# Altium project Track_Emulator.PrjPcb
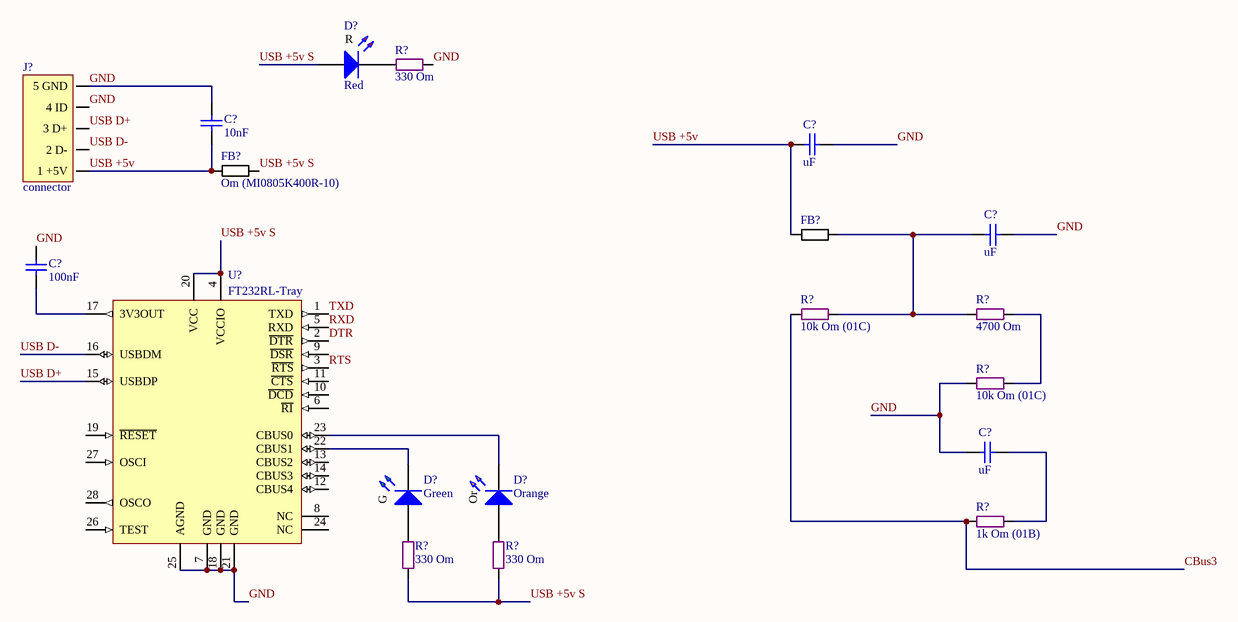
[diagram p0: Track_Emulator.SchDoc]
1 sheet, 19 parts. Net scope: global (net labels, ports and power ports of the same name join across sheets).

## Sheet Track_Emulator.SchDoc
size A4

### Parts
(Parts that share a designator on the sheet are numbered #1, #2 ... from top to bottom, then left to right.)
C?#1  10nF  [SMD 1206 (3216)]
C?#2  uF  [SMD 0805 (2012)]
C?#3  uF  [SMD 0805 (2012)]
C?#4  100nF  [SMD 1206 (3216)]
C?#5  uF  [SMD 0805 (2012)]
D?#1  Red  [LED SMD 0805 Red]
D?#2  Green  [LED SMD 0805 Green]
D?#3  Orange  [LED SMD 0805 Orange]
FB?#1  Om (MI0805K400R-10)  [SMD 1206 (3216)]
FB?#2  (no value)  [SMD 0805 (2012)]
J?  connector  [USB Mini]
R?#1  330 Om  [SMD 0805 (2012)]
R?#2  10k Om (01C)  [SMD 0805 (2012)]
R?#3  4700 Om  [SMD 0805 (2012)]
R?#4  10k Om (01C)  [SMD 0805 (2012)]
R?#5  1k Om (01B)  [SMD 0805 (2012)]
R?#6  330 Om  [SMD 0805 (2012)]
R?#7  330 Om  [SMD 0805 (2012)]
U?  FT232RL-Tray  [SSOP-28_N]

### Nets
CBus3: R?#2.1 R?#5.1
DTR: U?.2(~{DTR})
GND: C?#1.1 C?#2.2 C?#3.2 C?#4.1 C?#5.1 J?.4(4_ID) J?.5(5_GND) R?#1.2 R?#4.1 U?.7(GND) U?.18(GND) U?.21(GND) U?.25(AGND)
RTS: U?.3(~{RTS})
RXD: U?.5(RXD)
TXD: U?.1(TXD)
USB +5v: C?#1.2 C?#2.1 FB?#1.1 FB?#2.1 J?.1(1_+5V)
USB +5v S: D?#1.A FB?#1.2 R?#6.1 R?#7.1 U?.4(VCCIO) U?.20(VCC)
USB D+: J?.3(3_D+) U?.15(USBDP)
USB D-: J?.2(2_D-) U?.16(USBDM)
NetC?#3_1: C?#3.1 FB?#2.2 R?#2.2 R?#3.1
NetC?#4_2: C?#4.2 U?.17(3V3OUT)
NetC?#5_2: C?#5.2 R?#5.2
NetD?#1_K: D?#1.K R?#1.1
NetD?#2_A: D?#2.A R?#6.2
NetD?#2_K: D?#2.K U?.22(CBUS1)
NetD?#3_A: D?#3.A R?#7.2
NetD?#3_K: D?#3.K U?.23(CBUS0)
NetR?#3_2: R?#3.2 R?#4.2

Not connected (* = marked no-connect by the designer): U? 6(~{RI}) 8(NC) 9(~{DSR}) 10(~{DCD}) 11(~{CTS}) 12(CBUS4) 13(CBUS2) 14(CBUS3) 19(~{RESET}) 24(NC) 26(TEST) 27(OSCI) 28(OSCO)

### Notes on the sheet
- (in symbol Led SMD 0805 Green) G
- (in symbol Led SMD 0805 Orange) Or
- (in symbol Led SMD 0805 Red) R

### Library data of the parts
C?#1-C?#5 = Cap SMD 0402-1812: Capacitor
D?#1 = Led SMD 0805 Red: ?2v ?20mA; Forward Voltage TYP: ?2; Resistor for 5v VCC: 330 Om; Forward Voltage Min: ?; Wave len min/typ: ?; Liminous Min (mcd): ?; Liminous Typ (mcd): ?; Forward Amp (mA): ?; Color: Red
D?#2 = Led SMD 0805 Green: ?2v ?20mA; Forward Voltage TYP: ?2; Resistor for 5v VCC: 330 Om; Forward Voltage Min: ?; Wave len min/typ: ?; Liminous Min (mcd): ?; Liminous Typ (mcd): ?; Forward Amp (mA): ?; Color: Green
D?#3 = Led SMD 0805 Orange: ?2v ?20mA; Forward Voltage TYP: ?2; Resistor for 5v VCC: 330 Om; Forward Voltage Min: ?; Wave len min/typ: ?; Liminous Min (mcd): ?; Liminous Typ (mcd): ?; Forward Amp (mA): ?; Color: Orange
FB?#1 FB?#2 = Ferrite Bead
J? = USB mini: Mini USB
R?#1-R?#7 = Res SMD 0805
U? = FT232RL-Tray: USB UART Asynchronous Serial Data Transfer Chip, SSOP-28, Tray; Published: 19-Aug-2010; DatasheetVersion: ver 2.07, Jul-2010; PackageVersion: 2010; PackageReference: SSOP-28; Publisher: Altium Limited; PackageDescription: 28-Pin Small Outline Package 0.65 mm Pitch; ComponentLink1Description: Manufacturer Link; ComponentLink1URL: http://www.ftdichip.com/Products/ICs/FT232R.htm; ComponentLink2Description: Datasheet; ComponentLink2URL: http://www.ftdichip.com/Support/Documents/DataSheets/ICs/DS_FT232R.pdf